# EAGLE schematic LedExtensionBoard_x12 (EAGLE 9.1.3)
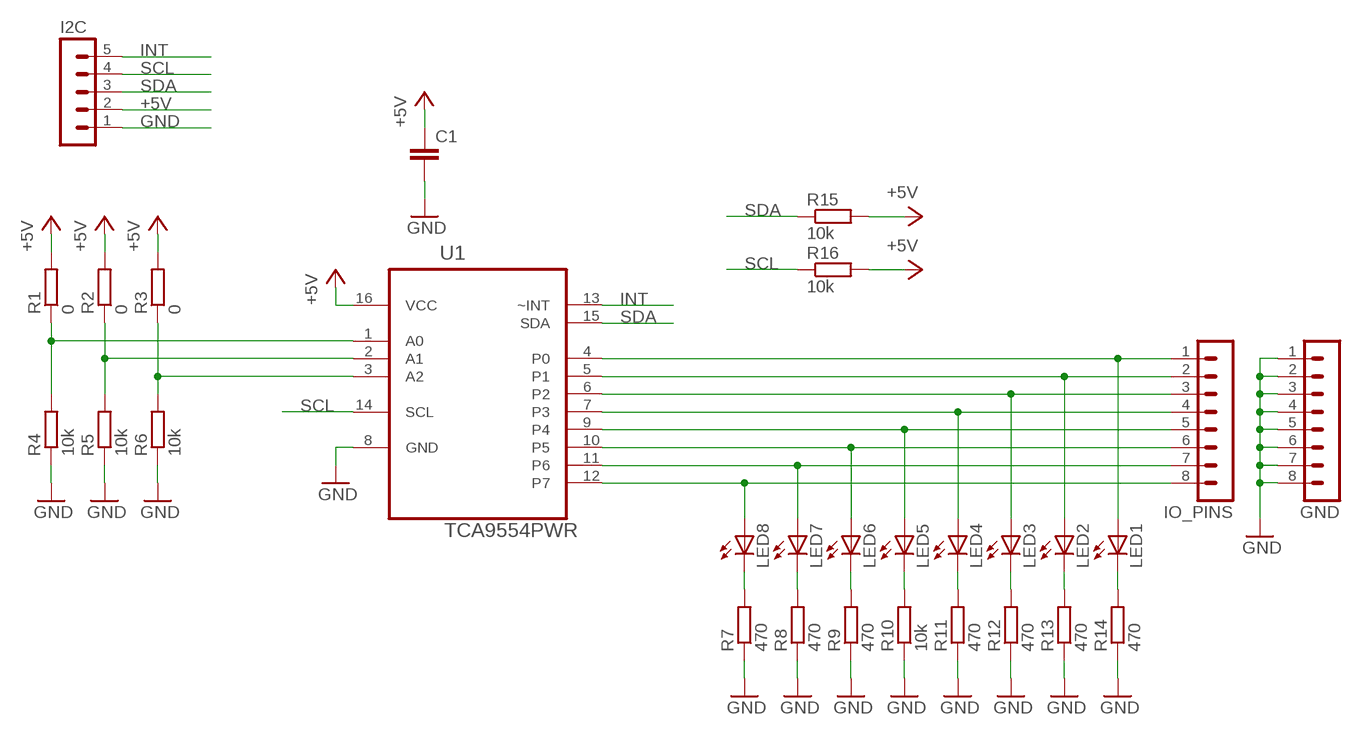
[diagram p0: schematic, sheet 1]

## Parts
C1  C-EUC0805  [C0805]
GND  MA08-1  [MA08-1]
I2C  MA05-1  [MA05-1]
IO_PINS  MA08-1  [MA08-1]
LED1  LEDSML0805  [SML0805]
LED2  LEDSML0805  [SML0805]
LED3  LEDSML0805  [SML0805]
LED4  LEDSML0805  [SML0805]
LED5  LEDSML0805  [SML0805]
LED6  LEDSML0805  [SML0805]
LED7  LEDSML0805  [SML0805]
LED8  LEDSML0805  [SML0805]
R1  0  R-EU_M1206  [M1206]
R2  0  R-EU_M1206  [M1206]
R3  0  R-EU_M1206  [M1206]
R4  10k  R-EU_M0805  [M0805]
R5  10k  R-EU_M0805  [M0805]
R6  10k  R-EU_M0805  [M0805]
R7  470  R-EU_M0805  [M0805]
R8  470  R-EU_M0805  [M0805]
R9  470  R-EU_M0805  [M0805]
R10  10k  R-EU_M0805  [M0805]
R11  470  R-EU_M0805  [M0805]
R12  470  R-EU_M0805  [M0805]
R13  470  R-EU_M0805  [M0805]
R14  470  R-EU_M0805  [M0805]
R15  10k  R-EU_M0805  [M0805]
R16  10k  R-EU_M0805  [M0805]
U1  TCA9554PWR  [SOP65P640X120-16N]

## Nets
+5V: C1.1 I2C.2 R1.2 R2.2 R3.2 R15.2 R16.2 U1.16(VCC)
GND: C1.2 GND.1 GND.2 GND.3 GND.4 GND.5 GND.6 GND.7 GND.8 I2C.1 R4.1 R5.1 R6.1 R7.1 R8.1 R9.1 R10.1 R11.1 R12.1 R13.1 R14.1 U1.8(GND)
INT: I2C.5 U1.13(~INT)
N$1: IO_PINS.8 LED8.A U1.12(P7)
N$2: IO_PINS.7 LED7.A U1.11(P6)
N$3: IO_PINS.6 LED6.A U1.10(P5)
N$4: IO_PINS.5 LED5.A U1.9(P4)
N$5: IO_PINS.4 LED4.A U1.7(P3)
N$6: IO_PINS.3 LED3.A U1.6(P2)
N$7: IO_PINS.2 LED2.A U1.5(P1)
N$8: IO_PINS.1 LED1.A U1.4(P0)
N$9: LED8.C R7.2
N$10: LED7.C R8.2
N$11: LED6.C R9.2
N$12: R1.1 R4.2 U1.1(A0)
N$13: R2.1 R5.2 U1.2(A1)
N$14: R3.1 R6.2 U1.3(A2)
N$15: LED5.C R10.2
N$16: LED4.C R11.2
N$17: LED3.C R12.2
N$18: LED2.C R13.2
N$19: LED1.C R14.2
SCL: I2C.4 R16.1 U1.14(SCL)
SDA: I2C.3 R15.1 U1.15(SDA)

## Library data of the parts
C1 = rcl:C-EU: CAPACITOR, European symbol
GND IO_PINS = con-lstb:MA08-1: PIN HEADER; OC_FARNELL: unknown; OC_NEWARK: unknown
I2C = con-lstb:MA05-1: PIN HEADER; OC_FARNELL: unknown; OC_NEWARK: unknown
LED1-LED8 = led:LED: LED OSRAM: - CHIPLED LG R971, LG N971, LY N971, LG Q971, LY Q971, LO R971, LY R971 LH N974, LH R974 LS Q976, LO Q976, LY Q976 LO Q996 - Hyper CHIPLED LW Q18S LB Q993, LB Q99A, LB R99A - SideLED LS A670, LO A670, LY A670, LG A670, LP A670 LB A673, LV A673, LT A673, LW A673 LH A674 LY A675 LS A676, LA A676, LO A676, LY A676, LW A676 LS A679, LY A679, LG A679 - Hyper Micro SIDELED® LS Y876, LA Y876, LO Y876, LY Y876 LT Y87S - SmartLED LW L88C, LW L88S LB L89C, LB L89S, LG L890 LS L89K, LO L89K, LY L89K LS L896, LA L896, LO L896, LY L896 - TOPLED LS T670, LO T670, LY T670, LG T670, LP T670 LSG T670, LSP T670, LSY T670, LOP T670, LYG T670 LG T671, LOG T671, LSG T671 LB T673, LV T673, LT T673, LW T673 LH T674 LS T676, LA T676, LO T676, LY T676, LB T676, LH T676, LSB T676, LW T676 LB T67C, LV T67C, LT T67C, LS T67K, LO T67K, LY T67K, LW E67C LS E67B, LA E67B, LO E67B, LY E67B, LB E67C, LV E67C, LT E67C LW T67C LS T679, LY T679, LG T679 LS T770, LO T770, LY T770, LG T770, LP T770 LB T773, LV T773, LT T773, LW T773 LH T774 LS E675, LA E675, LY E675, LS T675 LS T776, LA T776, LO T776, LY T776, LB T776 LHGB T686 LT T68C, LB T68C - Hyper Mini TOPLED® LB M676 - Mini TOPLED Santana® LG M470 LS M47K, LO M47K, LY M47K Source: http://www.osram.convergy.de LUXEON: - LUMILED® LXK2-PW12-R00, LXK2-PW12-S00, LXK2-PW14-U00, LXK2-PW14-V00 LXK2-PM12-R00, LXK2-PM12-S00, LXK2-PM14-U00 LXK2-PE12-Q00, LXK2-PE12-R00, LXK2-PE12-S00, LXK2-PE14-T00, LXK2-PE14-U00 LXK2-PB12-K00, LXK2-PB12-L00, LXK2-PB12-M00, LXK2-PB14-N00, LXK2-PB14-P00, LXK2-PB14-Q00 LXK2-PR12-L00, LXK2-PR12-M00, LXK2-PR14-Q00, LXK2-PR14-R00 LXK2-PD12-Q00, LXK2-PD12-R00, LXK2-PD12-S00 LXK2-PH12-R00, LXK2-PH12-S00 LXK2-PL12-P00, LXK2-PL12-Q00, LXK2-PL12-R00 Source: www.luxeon.com KINGBRIGHT: KA-3528ASYC Source: www.kingbright.com
R1-R16 = rcl:R-EU_: RESISTOR, European symbol
U1 = TCA9554PWR:TCA9554PWR: 8-BIT I2C AND SMBus I/O EXPANDER; AVAILABILITY: Unavailable; DESCRIPTION: Interface - I/O Expanders Remote 8-B I2C & SM Bus I/O Expander; MF: Texas Instruments; MP: TCA9554PWR; PACKAGE: TSSOP-16 Texas Instruments; PRICE: None